# Altium schematic sheet mcu0_primary.SchDoc: foxBMS BMS-Master
size A3; DocumentNumber: 4; SheetNumber: 4; SheetTotal: 24; Author: Fraunhofer IISB foxBMS Team; REL-DATE: 2017-05-16; VERSION: 1.0.2; SheetDescription: MCU0 (Primary)
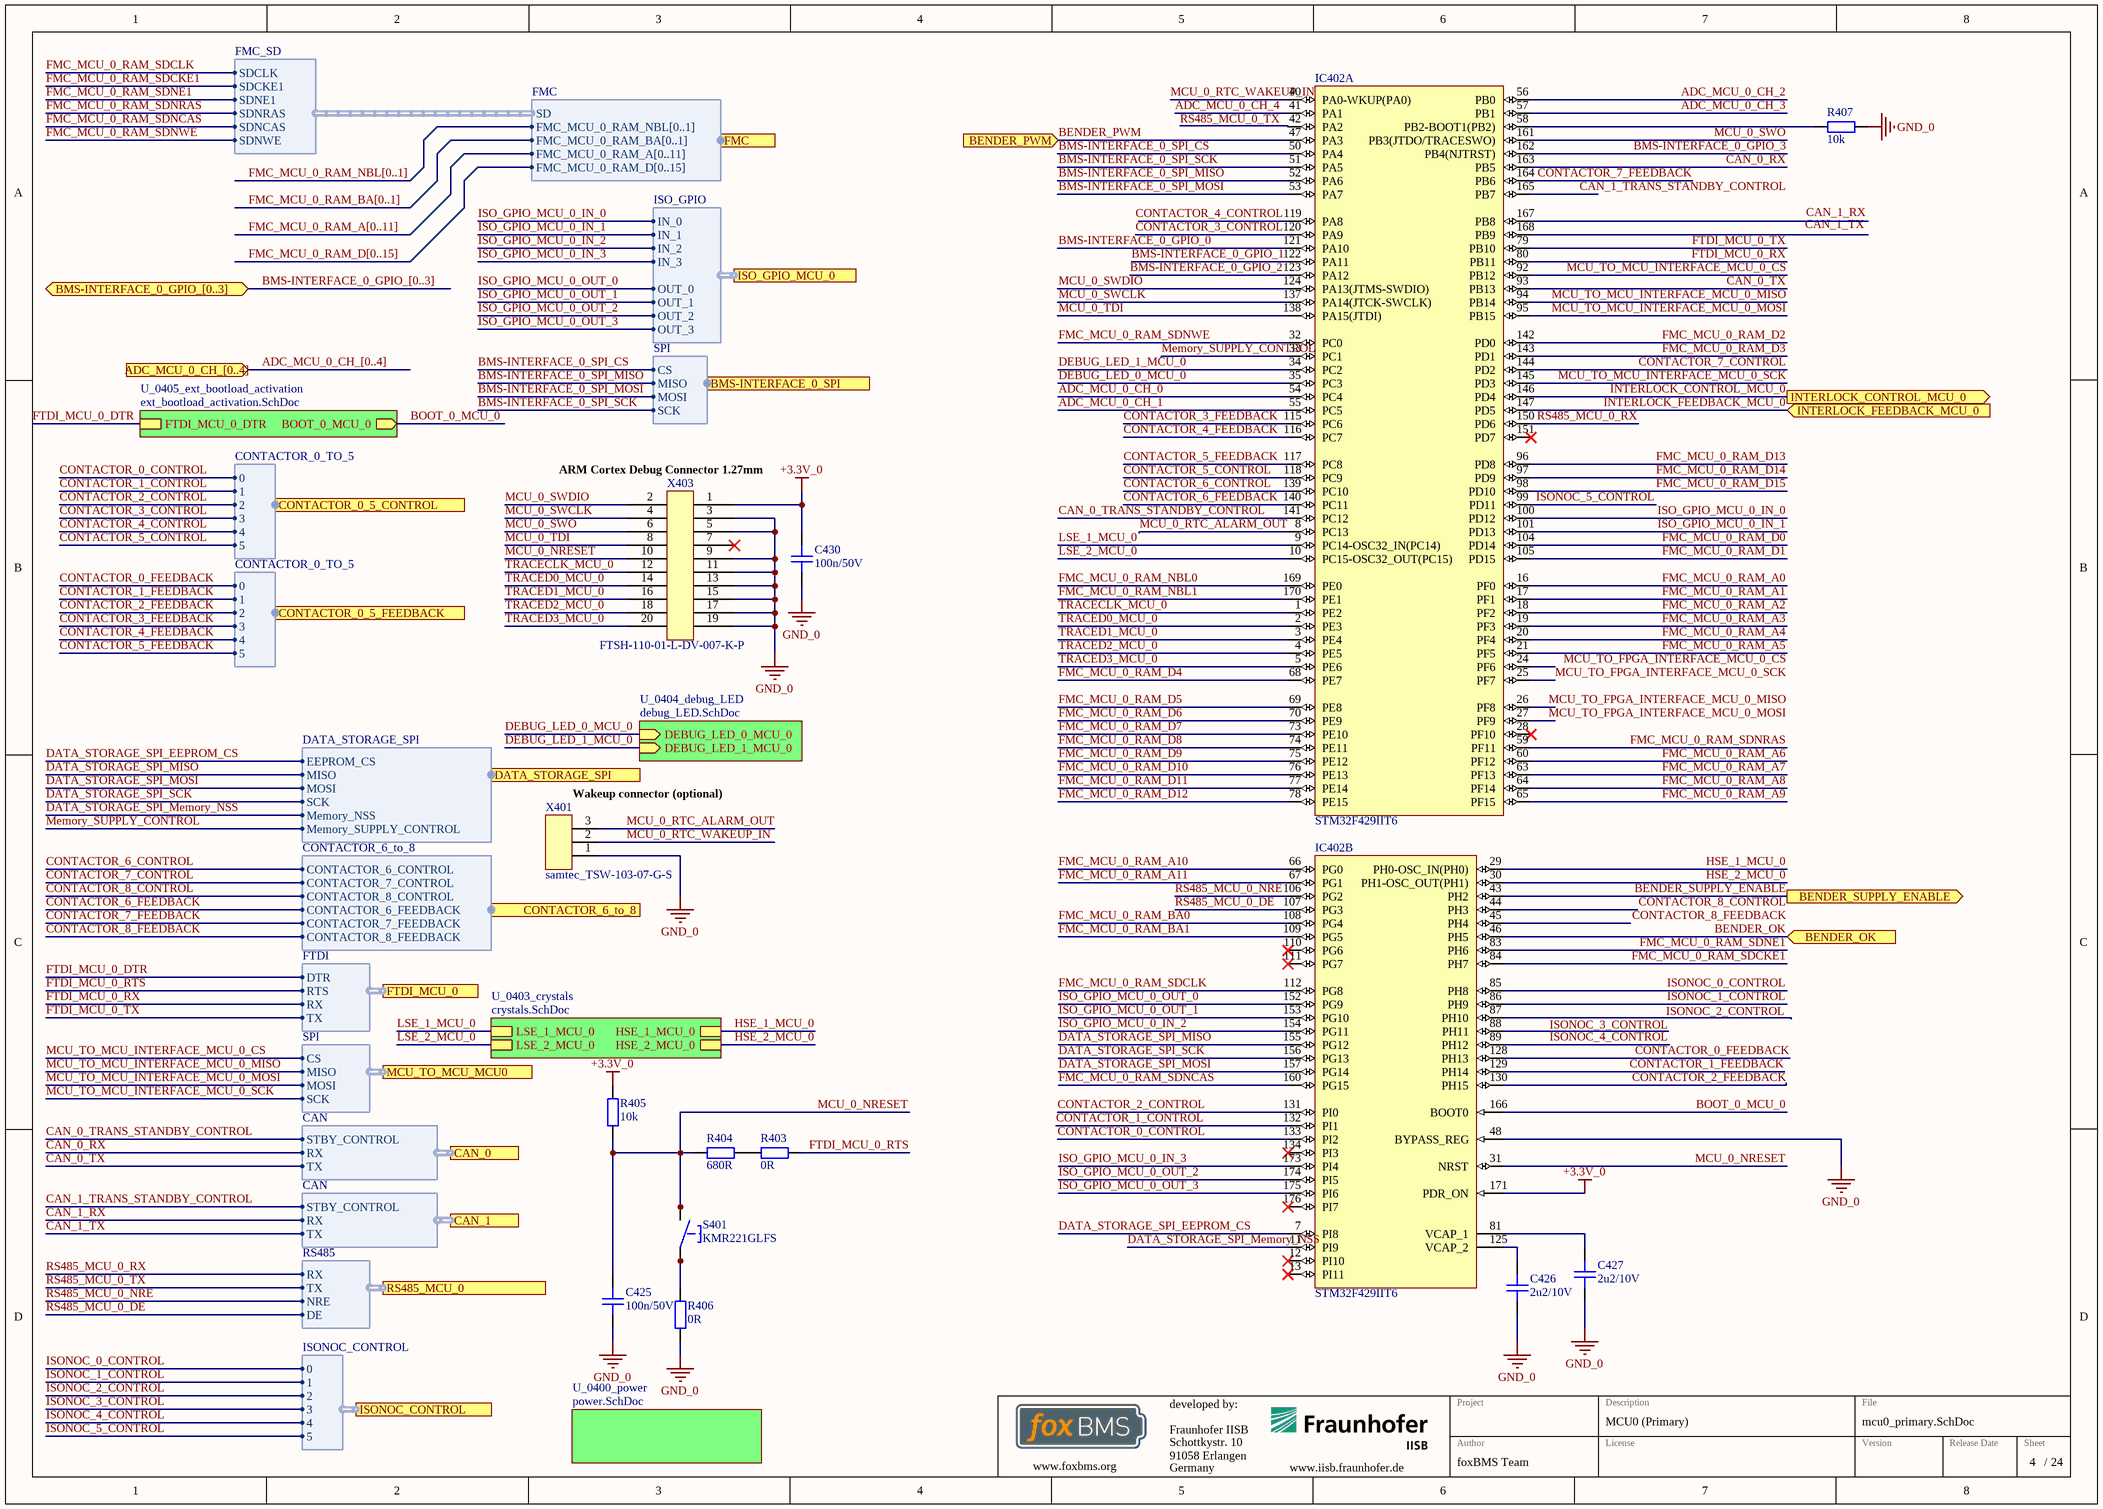
[diagram p0: mcu0_primary.SchDoc]

## Parts
C425  100n/50V  [CAPC1608X08N]
C426  2u2/10V  [CAPC1608X08N]
C427  2u2/10V  [CAPC1608X08N]
C430  100n/50V  [CAPC1608X08N]
IC402  STM32F429IIT6  [STM-LQFP176_N]  (parts A,B of 3)
R403  0R  [RESC1608X05N]
R404  680R  [RESC1608X05N]
R405  10k  [RESC1608X05N]
R406  0R  [RESC1608X05N]
R407  10k  [RESC1608X05N]
S401  KMR221GLFS  [KMR2_Series]
X401  samtec_TSW-103-07-G-S  [Pinheader_2.54_3]
X403  FTSH-110-01-L-DV-007-K-P  [CORTEX_DEBUG_20_PIN]

## Sub-sheets
U_0400_power = power.SchDoc: no entries
U_0403_crystals = crystals.SchDoc: LSE_1_MCU_0, LSE_2_MCU_0, HSE_1_MCU_0, HSE_2_MCU_0
U_0404_debug_LED = debug_LED.SchDoc: DEBUG_LED_0_MCU_0 (in), DEBUG_LED_1_MCU_0 (in)
U_0405_ext_bootload_activation = ext_bootload_activation.SchDoc: FTDI_MCU_0_DTR, BOOT_0_MCU_0 (out)

## Ports
ADC_MCU_0_CH_[0..4] (in), BENDER_OK (in), BENDER_PWM (in), BENDER_SUPPLY_ENABLE (out), BMS-INTERFACE_0_GPIO_[0..3] (bidir, harness CAN), BMS-INTERFACE_0_SPI (harness SPI), CAN_0 (harness CAN), CAN_1 (harness CAN), CONTACTOR_0_5_CONTROL (harness CONTACTOR_0_TO_5), CONTACTOR_0_5_FEEDBACK (harness CONTACTOR_0_TO_5), CONTACTOR_6_to_8 (harness CONTACTOR_6_to_8), DATA_STORAGE_SPI (harness DATA_STORAGE_SPI), FMC (harness FMC), FTDI_MCU_0 (harness FTDI), INTERLOCK_CONTROL_MCU_0 (out), INTERLOCK_FEEDBACK_MCU_0 (in), ISO_GPIO_MCU_0 (harness ISO_GPIO), ISONOC_CONTROL (harness ISONOC_CONTROL), MCU_TO_MCU_MCU0 (harness SPI), RS485_MCU_0 (harness RS485)

## Harnesses
FMC_SD: SDCLK, SDCKE1, SDNE1, SDNRAS, SDNWE, SDNCAS
FMC: SD, FMC_MCU_0_RAM_NBL[0..1], FMC_MCU_0_RAM_BA[0..1], FMC_MCU_0_RAM_A[0..11], FMC_MCU_0_RAM_D[0..15]
DATA_STORAGE_SPI: EEPROM_CS, MISO, MOSI, SCK, Memory_NSS, Memory_SUPPLY_CONTROL
CONTACTOR_6_to_8: CONTACTOR_6_CONTROL, CONTACTOR_7_CONTROL, CONTACTOR_8_CONTROL, CONTACTOR_6_FEEDBACK, CONTACTOR_7_FEEDBACK, CONTACTOR_8_FEEDBACK
SPI: CS, MISO, MOSI, SCK
FTDI: DTR, RTS, RX, TX
CAN: STBY_CONTROL, RX, TX
RS485: RX, TX, NRE, DE
ISONOC_CONTROL: 0, 1, 2, 3, 4, 5
ISO_GPIO: IN_0, IN_1, IN_2, IN_3, OUT_3, OUT_0, OUT_1, OUT_2
CONTACTOR_0_TO_5: 0, 1, 2, 3, 4, 5

## Nets
+3.3V_0: C430.1 IC402.171(PDR_ON) R405.2 X403.1
GND_0: C425.2 C426.2 C427.2 C430.2 IC402.48(BYPASS_REG) R406.1 R407.1 X401.1 X403.3 X403.5 X403.9 X403.11 X403.13 X403.15 X403.17 X403.19
ADC_MCU_0_CH_0: IC402.54(PC4)
ADC_MCU_0_CH_1: IC402.55(PC5)
ADC_MCU_0_CH_2: IC402.56(PB0)
ADC_MCU_0_CH_3: IC402.57(PB1)
ADC_MCU_0_CH_4: IC402.41(PA1)
BENDER_OK: IC402.46(PH5) ; port BENDER_OK
BENDER_PWM: IC402.47(PA3) ; port BENDER_PWM
BENDER_SUPPLY_ENABLE: IC402.43(PH2) ; port BENDER_SUPPLY_ENABLE
BMS-INTERFACE_0_GPIO_0: IC402.121(PA10)
BMS-INTERFACE_0_GPIO_1: IC402.122(PA11)
BMS-INTERFACE_0_GPIO_2: IC402.123(PA12)
BMS-INTERFACE_0_GPIO_3: IC402.162(PB4(NJTRST))
BMS-INTERFACE_0_SPI_CS: IC402.50(PA4) ; port BMS-INTERFACE_0_SPI.CS
BMS-INTERFACE_0_SPI_MISO: IC402.52(PA6) ; port BMS-INTERFACE_0_SPI.MISO
BMS-INTERFACE_0_SPI_MOSI: IC402.53(PA7) ; port BMS-INTERFACE_0_SPI.MOSI
BMS-INTERFACE_0_SPI_SCK: IC402.51(PA5) ; port BMS-INTERFACE_0_SPI.SCK
BOOT_0_MCU_0: IC402.166(BOOT0) ; sheet U_0405_ext_bootload_activation/BOOT_0_MCU_0
CAN_0_RX: IC402.163(PB5) ; port CAN_0.RX
CAN_0_TRANS_STANDBY_CONTROL: IC402.141(PC12) ; port CAN_0.STBY_CONTROL
CAN_0_TX: IC402.93(PB13) ; port CAN_0.TX
CAN_1_RX: port CAN_1.RX
CAN_1_TRANS_STANDBY_CONTROL: port CAN_1.STBY_CONTROL
CAN_1_TX: port CAN_1.TX
CONTACTOR_0_CONTROL: IC402.133(PI2) ; port CONTACTOR_0_5_CONTROL.0
CONTACTOR_0_FEEDBACK: IC402.128(PH13) ; port CONTACTOR_0_5_FEEDBACK.0
CONTACTOR_1_CONTROL: IC402.132(PI1) ; port CONTACTOR_0_5_CONTROL.1
CONTACTOR_1_FEEDBACK: IC402.129(PH14) ; port CONTACTOR_0_5_FEEDBACK.1
CONTACTOR_2_CONTROL: IC402.131(PI0) ; port CONTACTOR_0_5_CONTROL.2
CONTACTOR_2_FEEDBACK: port CONTACTOR_0_5_FEEDBACK.2
CONTACTOR_3_CONTROL: IC402.120(PA9) ; port CONTACTOR_0_5_CONTROL.3
CONTACTOR_3_FEEDBACK: IC402.115(PC6) ; port CONTACTOR_0_5_FEEDBACK.3
CONTACTOR_4_CONTROL: port CONTACTOR_0_5_CONTROL.4
CONTACTOR_4_FEEDBACK: IC402.116(PC7) ; port CONTACTOR_0_5_FEEDBACK.4
CONTACTOR_5_CONTROL: IC402.118(PC9) ; port CONTACTOR_0_5_CONTROL.5
CONTACTOR_5_FEEDBACK: IC402.117(PC8) ; port CONTACTOR_0_5_FEEDBACK.5
CONTACTOR_6_CONTROL: IC402.139(PC10) ; port CONTACTOR_6_to_8.CONTACTOR_6_CONTROL
CONTACTOR_6_FEEDBACK: IC402.140(PC11) ; port CONTACTOR_6_to_8.CONTACTOR_6_FEEDBACK
CONTACTOR_7_CONTROL: IC402.144(PD2) ; port CONTACTOR_6_to_8.CONTACTOR_7_CONTROL
CONTACTOR_7_FEEDBACK: IC402.164(PB6) ; port CONTACTOR_6_to_8.CONTACTOR_7_FEEDBACK
CONTACTOR_8_CONTROL: port CONTACTOR_6_to_8.CONTACTOR_8_CONTROL
CONTACTOR_8_FEEDBACK: port CONTACTOR_6_to_8.CONTACTOR_8_FEEDBACK
DATA_STORAGE_SPI_EEPROM_CS: IC402.7(PI8) ; port DATA_STORAGE_SPI.EEPROM_CS
DATA_STORAGE_SPI_Memory_NSS: IC402.11(PI9) ; port DATA_STORAGE_SPI.Memory_NSS
DATA_STORAGE_SPI_MISO: IC402.155(PG12) ; port DATA_STORAGE_SPI.MISO
DATA_STORAGE_SPI_MOSI: IC402.157(PG14) ; port DATA_STORAGE_SPI.MOSI
DATA_STORAGE_SPI_SCK: IC402.156(PG13) ; port DATA_STORAGE_SPI.SCK
DEBUG_LED_0_MCU_0: IC402.35(PC3) ; sheet U_0404_debug_LED/DEBUG_LED_0_MCU_0
DEBUG_LED_1_MCU_0: IC402.34(PC2) ; sheet U_0404_debug_LED/DEBUG_LED_1_MCU_0
FMC_MCU_0_RAM_A0: IC402.16(PF0)
FMC_MCU_0_RAM_A1: IC402.17(PF1)
FMC_MCU_0_RAM_A2: IC402.18(PF2)
FMC_MCU_0_RAM_A3: IC402.19(PF3)
FMC_MCU_0_RAM_A4: IC402.20(PF4)
FMC_MCU_0_RAM_A5: IC402.21(PF5)
FMC_MCU_0_RAM_A6: IC402.60(PF12)
FMC_MCU_0_RAM_A7: IC402.63(PF13)
FMC_MCU_0_RAM_A8: IC402.64(PF14)
FMC_MCU_0_RAM_A9: IC402.65(PF15)
FMC_MCU_0_RAM_A10: IC402.66(PG0)
FMC_MCU_0_RAM_A11: IC402.67(PG1)
FMC_MCU_0_RAM_BA0: IC402.108(PG4)
FMC_MCU_0_RAM_BA1: IC402.109(PG5)
FMC_MCU_0_RAM_D0: IC402.104(PD14)
FMC_MCU_0_RAM_D1: IC402.105(PD15)
FMC_MCU_0_RAM_D2: IC402.142(PD0)
FMC_MCU_0_RAM_D3: IC402.143(PD1)
FMC_MCU_0_RAM_D4: IC402.68(PE7)
FMC_MCU_0_RAM_D5: IC402.69(PE8)
FMC_MCU_0_RAM_D6: IC402.70(PE9)
FMC_MCU_0_RAM_D7: IC402.73(PE10)
FMC_MCU_0_RAM_D8: IC402.74(PE11)
FMC_MCU_0_RAM_D9: IC402.75(PE12)
FMC_MCU_0_RAM_D10: IC402.76(PE13)
FMC_MCU_0_RAM_D11: IC402.77(PE14)
FMC_MCU_0_RAM_D12: IC402.78(PE15)
FMC_MCU_0_RAM_D13: IC402.96(PD8)
FMC_MCU_0_RAM_D14: IC402.97(PD9)
FMC_MCU_0_RAM_D15: IC402.98(PD10)
FMC_MCU_0_RAM_NBL0: IC402.169(PE0)
FMC_MCU_0_RAM_NBL1: IC402.170(PE1)
FMC_MCU_0_RAM_SDCKE1: IC402.84(PH7) ; harness FMC_SD.SDCKE1
FMC_MCU_0_RAM_SDCLK: IC402.112(PG8) ; harness FMC_SD.SDCLK
FMC_MCU_0_RAM_SDNCAS: IC402.160(PG15) ; harness FMC_SD.SDNCAS
FMC_MCU_0_RAM_SDNE1: IC402.83(PH6) ; harness FMC_SD.SDNE1
FMC_MCU_0_RAM_SDNRAS: IC402.59(PF11) ; harness FMC_SD.SDNRAS
FMC_MCU_0_RAM_SDNWE: IC402.32(PC0) ; harness FMC_SD.SDNWE
FTDI_MCU_0_DTR: sheet U_0405_ext_bootload_activation/FTDI_MCU_0_DTR, port FTDI_MCU_0.DTR
FTDI_MCU_0_RTS: R403.2 ; port FTDI_MCU_0.RTS
FTDI_MCU_0_RX: IC402.80(PB11) ; port FTDI_MCU_0.RX
FTDI_MCU_0_TX: IC402.79(PB10) ; port FTDI_MCU_0.TX
HSE_1_MCU_0: IC402.29(PH0-OSC_IN(PH0)) ; sheet U_0403_crystals/HSE_1_MCU_0
HSE_2_MCU_0: IC402.30(PH1-OSC_OUT(PH1)) ; sheet U_0403_crystals/HSE_2_MCU_0
INTERLOCK_CONTROL_MCU_0: IC402.146(PD4) ; port INTERLOCK_CONTROL_MCU_0
INTERLOCK_FEEDBACK_MCU_0: IC402.147(PD5) ; port INTERLOCK_FEEDBACK_MCU_0
ISO_GPIO_MCU_0_IN_0: IC402.100(PD12) ; port ISO_GPIO_MCU_0.IN_0
ISO_GPIO_MCU_0_IN_1: IC402.101(PD13) ; port ISO_GPIO_MCU_0.IN_1
ISO_GPIO_MCU_0_IN_2: IC402.154(PG11) ; port ISO_GPIO_MCU_0.IN_2
ISO_GPIO_MCU_0_IN_3: IC402.173(PI4) ; port ISO_GPIO_MCU_0.IN_3
ISO_GPIO_MCU_0_OUT_0: IC402.152(PG9) ; port ISO_GPIO_MCU_0.OUT_0
ISO_GPIO_MCU_0_OUT_1: IC402.153(PG10) ; port ISO_GPIO_MCU_0.OUT_1
ISO_GPIO_MCU_0_OUT_2: IC402.174(PI5) ; port ISO_GPIO_MCU_0.OUT_2
ISO_GPIO_MCU_0_OUT_3: IC402.175(PI6) ; port ISO_GPIO_MCU_0.OUT_3
ISONOC_0_CONTROL: IC402.85(PH8) ; port ISONOC_CONTROL.0
ISONOC_1_CONTROL: IC402.86(PH9) ; port ISONOC_CONTROL.1
ISONOC_2_CONTROL: port ISONOC_CONTROL.2
ISONOC_3_CONTROL: port ISONOC_CONTROL.3
ISONOC_4_CONTROL: IC402.89(PH12) ; port ISONOC_CONTROL.4
ISONOC_5_CONTROL: IC402.99(PD11) ; port ISONOC_CONTROL.5
LSE_1_MCU_0: IC402.9(PC14-OSC32_IN(PC14)) ; sheet U_0403_crystals/LSE_1_MCU_0
LSE_2_MCU_0: IC402.10(PC15-OSC32_OUT(PC15)) ; sheet U_0403_crystals/LSE_2_MCU_0
MCU_0_NRESET: C425.1 IC402.31(NRST) R404.1 R405.1 S401.3 S401.4 X403.10
MCU_0_RTC_ALARM_OUT: IC402.8(PC13) X401.3
MCU_0_RTC_WAKEUP_IN: IC402.40(PA0-WKUP(PA0)) X401.2
MCU_0_SWCLK: IC402.137(PA14(JTCK-SWCLK)) X403.4
MCU_0_SWDIO: IC402.124(PA13(JTMS-SWDIO)) X403.2
MCU_0_SWO: IC402.161(PB3(JTDO/TRACESWO)) X403.6
MCU_0_TDI: IC402.138(PA15(JTDI)) X403.8
MCU_TO_MCU_INTERFACE_MCU_0_CS: IC402.92(PB12) ; port MCU_TO_MCU_MCU0.CS
MCU_TO_MCU_INTERFACE_MCU_0_MISO: IC402.94(PB14) ; port MCU_TO_MCU_MCU0.MISO
MCU_TO_MCU_INTERFACE_MCU_0_MOSI: IC402.95(PB15) ; port MCU_TO_MCU_MCU0.MOSI
MCU_TO_MCU_INTERFACE_MCU_0_SCK: IC402.145(PD3) ; port MCU_TO_MCU_MCU0.SCK
Memory_SUPPLY_CONTROL: IC402.33(PC1) ; port DATA_STORAGE_SPI.Memory_SUPPLY_CONTROL
RS485_MCU_0_DE: IC402.107(PG3) ; port RS485_MCU_0.DE
RS485_MCU_0_NRE: IC402.106(PG2) ; port RS485_MCU_0.NRE
RS485_MCU_0_RX: IC402.150(PD6) ; port RS485_MCU_0.RX
RS485_MCU_0_TX: port RS485_MCU_0.TX
TRACECLK_MCU_0: IC402.1(PE2) X403.12
TRACED0_MCU_0: IC402.2(PE3) X403.14
TRACED1_MCU_0: IC402.3(PE4) X403.16
TRACED2_MCU_0: IC402.4(PE5) X403.18
TRACED3_MCU_0: IC402.5(PE6) X403.20
NetC426_1: C426.1 IC402.125(VCAP_2)
NetC427_1: C427.1 IC402.81(VCAP_1)
NetIC402_58: IC402.58(PB2-BOOT1(PB2)) R407.2
NetR403_1: R403.1 R404.2
NetR406_2: R406.2 S401.1 S401.2

Not connected (* = marked no-connect by the designer): IC402 12(PI10)* 13(PI11)* 24(PF6) 25(PF7) 26(PF8) 27(PF9) 28(PF10)* 42(PA2) 44(PH3) 45(PH4) 87(PH10) 88(PH11) 110(PG6)* 111(PG7)* 119(PA8) 130(PH15) 134(PI3)* 151(PD7)* 165(PB7) 167(PB8) 168(PB9) 176(PI7)*; X403 7*

## Buses and harness runs
bus ADC_MCU_0_CH_[0..4] = port ADC_MCU_0_CH_[0..4]
bus BMS-INTERFACE_0_GPIO_[0..3]
bus FMC_MCU_0_RAM_A[0..11]
bus FMC_MCU_0_RAM_BA[0..1]
bus FMC_MCU_0_RAM_D[0..15]
bus FMC_MCU_0_RAM_NBL[0..1]

## Notes on the sheet
- (near X403) ARM Cortex Debug Connector 1.27mm
- (near X401) Wakeup connector (optional)
- Labels drawn without touching a wire or pin: CAN_1_RX, CAN_1_TRANS_STANDBY_CONTROL, CAN_1_TX, CONTACTOR_2_FEEDBACK, CONTACTOR_4_CONTROL, CONTACTOR_8_CONTROL, CONTACTOR_8_FEEDBACK, ISONOC_2_CONTROL, ISONOC_3_CONTROL, MCU_TO_FPGA_INTERFACE_MCU_0_CS, MCU_TO_FPGA_INTERFACE_MCU_0_MISO, MCU_TO_FPGA_INTERFACE_MCU_0_MOSI, MCU_TO_FPGA_INTERFACE_MCU_0_SCK, RS485_MCU_0_TX
- Fraunhofer IISB
- Schottkystr. 10
- developed by:
- 91058 Erlangen
- Germany
- Author
- Project
- License
- Description
- File
- Version
- Release Date
- Sheet
- www.foxbms.org
- www.iisb.fraunhofer.de
- foxBMS Team
- /

## Library data of the parts
C425 C430 = gen_C_ceramic_100n_50V_X7R_0603: MLCC; Capacitance: 100n; Rated Voltage: 50V; Dielectric: X7R; Case EIA: 0603; Case Metric: 1608; PnP Package: C_0603_10; PnP Value: 100n/50V/X7R; PnP equipped: x; Automotive Qualified: False; Part Number: gen_C_ceramic_100n_50V_X7R_0603; Supplier 1: Farnell; Supplier Part Number 1: 2525267; Supplier 2: Digikey; Supplier Part Number 2: 490-6049-1-ND
C426 C427 = gen_C_ceramic_2u2_10V_X5R_0603: MLCC; Capacitance: 2u2; Rated Voltage: 10V; Dielectric: X5R; Case EIA: 0603; Case Metric: 1608; AVT Set: x; Automotive Qualified: False; Part Number: gen_C_ceramic_2u2_10V_X5R_0603; Supplier 1: Farnell; Supplier Part Number 1: 2320817
IC402 = CMP-0243-00078-2: ARM Cortex-M4 32-bit MCU+FPU, 225 DMIPS, 2048 kB Flash, 256 kB Internal RAM, 140 I/Os, 176-pin LQFP, -40 to 85 degC, Tray; Manufacturer: STMicroelectronics; Internal RAM Size (kB): 256; I/Os (High Current): 140; FLASH Size (Prog) (kB): 2048; D/A Converter: 2x12-bit; Supply Voltage(Vcc) max (V): 3.6; Operating Frequency(F) (Processor speed) (MHz): 180; Supply Voltage(Vcc) min (V): 1.8; Core: ARM Cortex-M4; PackageReference: LQFP176; ComponentLink1Description: Manufacturer URL; Packing: Tray; ComponentLink2Description: Datasheet; ComponentLink3Description: Package Specification; ComponentLink2URL: http://www.st.com/st-web-ui/static/active/en/resource/technical/document/data_brief/DM00053488.pdf; PackageVersion: Rev. 4, 06/2013; ComponentLink1URL: http://www.st.com/web/en/home.html; DatasheetVersion: Rev. 2; PartNumber: STM32F429IIT6; PackageDescription: 176-Pin Low Profile Quad Flat Package, 24 x 24 mm Body, 0.5 mm Pitch; ComponentLink3URL: http://www.st.com/st-web-ui/static/active/en/resource/technical/document/datasheet/DM00035129.pdf; Mounting Technology: Surface Mount
R403 R406 = gen_R_0R_0603: SMD Resistor 0R 0603; Power: 0.1W; Case EIA: 0603; Case Metric: 1608; PnP Package: R_0603; Maximum Working Voltage: 75V; Automotive Qualified: False; Part Number: gen_R_0R_0603; Operating Temperature: -55°C - +155°C; Resistance: 0R; Series: Jumper; PnP Value: 0R; Supplier 1: Farnell; Supplier Part Number 1: 2073345
R404 = gen_R_680R_0603: SMD Resistor 680R 0603; Tolerance: 1%; Power: 0.1W; Case EIA: 0603; Case Metric: 1608; Maximum Working Voltage: 75V; PnP Package: R_0603; Automotive Qualified: False; Part Number: gen_R_680R_0603; Operating Temperature: -55°C - +155°C; Resistance: 680R; Series: E24; PnP Value: 680R; Supplier 1: Farnell; Supplier Part Number 1: 2797303
R405 R407 = gen_R_10k_0603: SMD Resistor 10k 0603; Tolerance: 1%; Power: 0.1W; Case EIA: 0603; Case Metric: 1608; Maximum Working Voltage: 75V; PnP Package: R_0603; Automotive Qualified: False; Part Number: gen_R_10k_0603; Operating Temperature: -55°C - +155°C; Resistance: 10k; Series: E24, E96; PnP Value: 10k; Supplier 1: Farnell; Supplier Part Number 1: 2073349
S401 = KMR221GLFS: Microminiature Tactile Switch; Manufacturer: CK Components; Automotive Qualified: False; Part Number: KMR221GLFS; Operating Temperature: -40°C - +85°C; ComponentLink1Description: Datasheet; ComponentLink1URL: http://www.farnell.com/datasheets/1685525.pdf; Supplier 1: Farnell; Supplier Part Number 1: 1201424; Supplier 2: Digikey; Supplier Part Number 2: 401-1426-1-ND; Supplier 3: Mouser; Supplier Part Number 3: 611-KMR211G-LFS
X401 = samtec_TSW-103-07-G-S: Board-To-Board Connector, Vertical, 2.54 mm, 3 Contacts, Header, TSW Series, Through Hole, 1 Row; Manufacturer: Samtec; Circuits: 3; Automotive Qualified: False; Part Number: samtec_TSW-103-07-G-S; Part Name: TSW-103-07-G-S; Operating Temperature: -55°C - +125°C; ComponentLink1Description: Datasheet; ComponentLink1URL: http://www.farnell.com/datasheets/1796313.pdf; Supplier 1: Farnell; Supplier Part Number 1: 2505045
X403 = samtec_FTSH-110-01-L-DV-007-K-P: Board-To-Board Connector, ARM Cortex Debug Header 20 Pin; Manufacturer: Samtec; Circuits: 20; Automotive Qualified: False; Part Number: samtec_FTSH-110-01-L-DV-007-K-P; Part Name: FTSH-110-01-L-DV-007-K-P; Operating Temperature: -55°C - +125°C; Supplier 1: Digikey; Supplier Part Number 1: SAM11268-ND; Supplier 2: Avnet; Supplier Part Number 2: FTSH-110-01-L-DV-007-K-P